# EAGLE schematic RubyWaves (EAGLE 9.6.2)
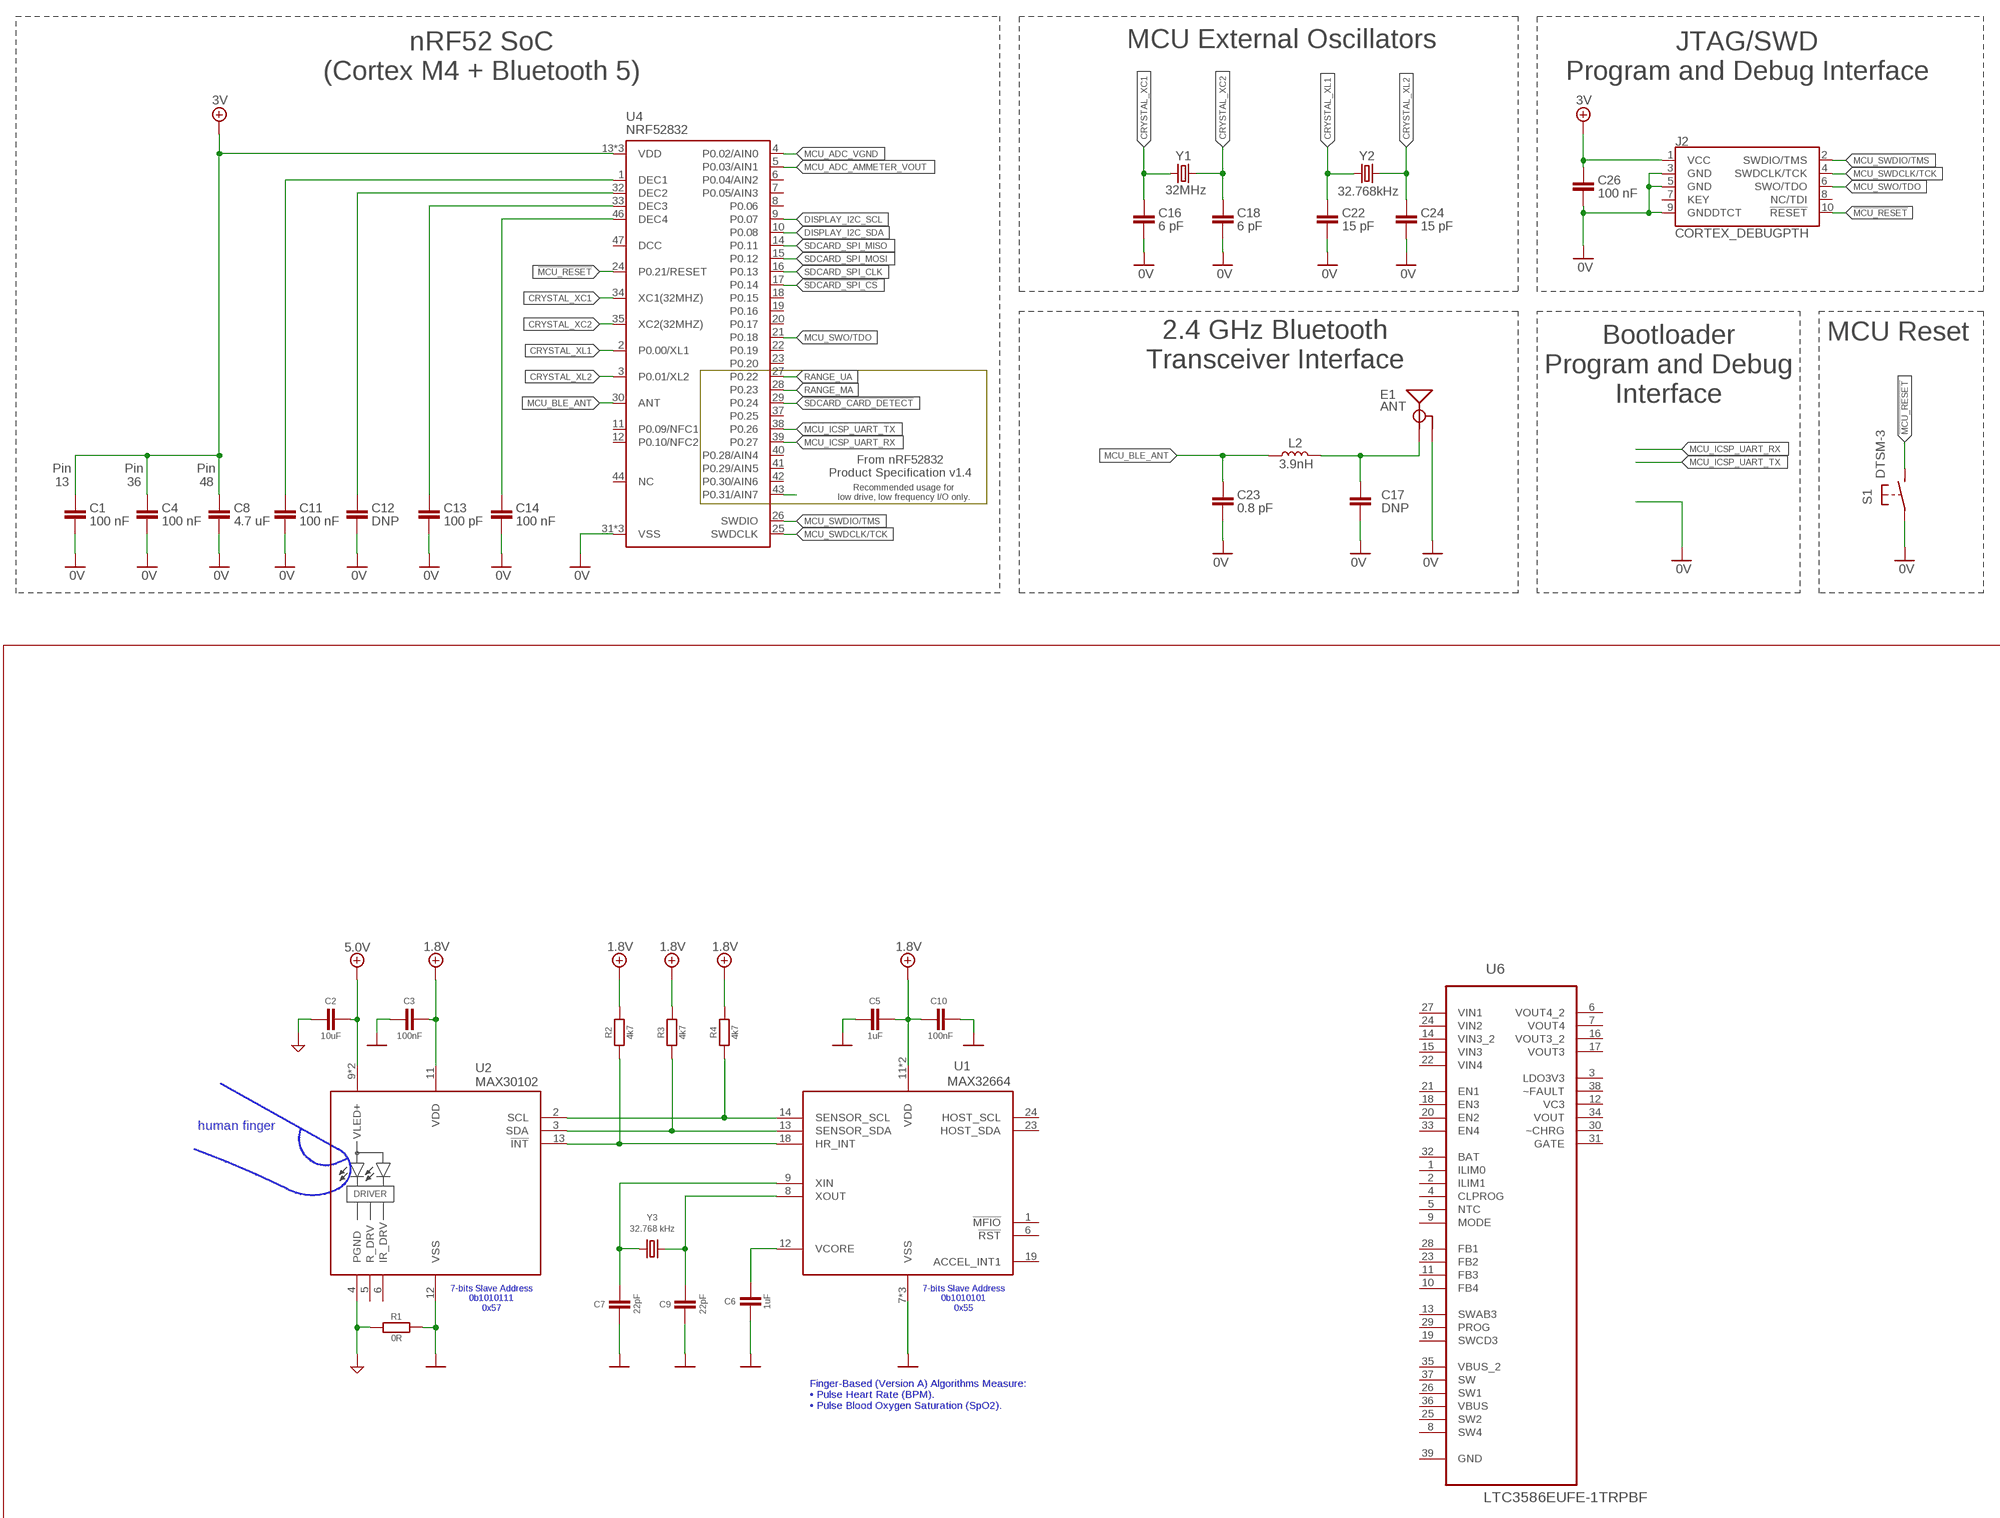
[diagram p0: schematic, sheet 1, part 1 of 2]
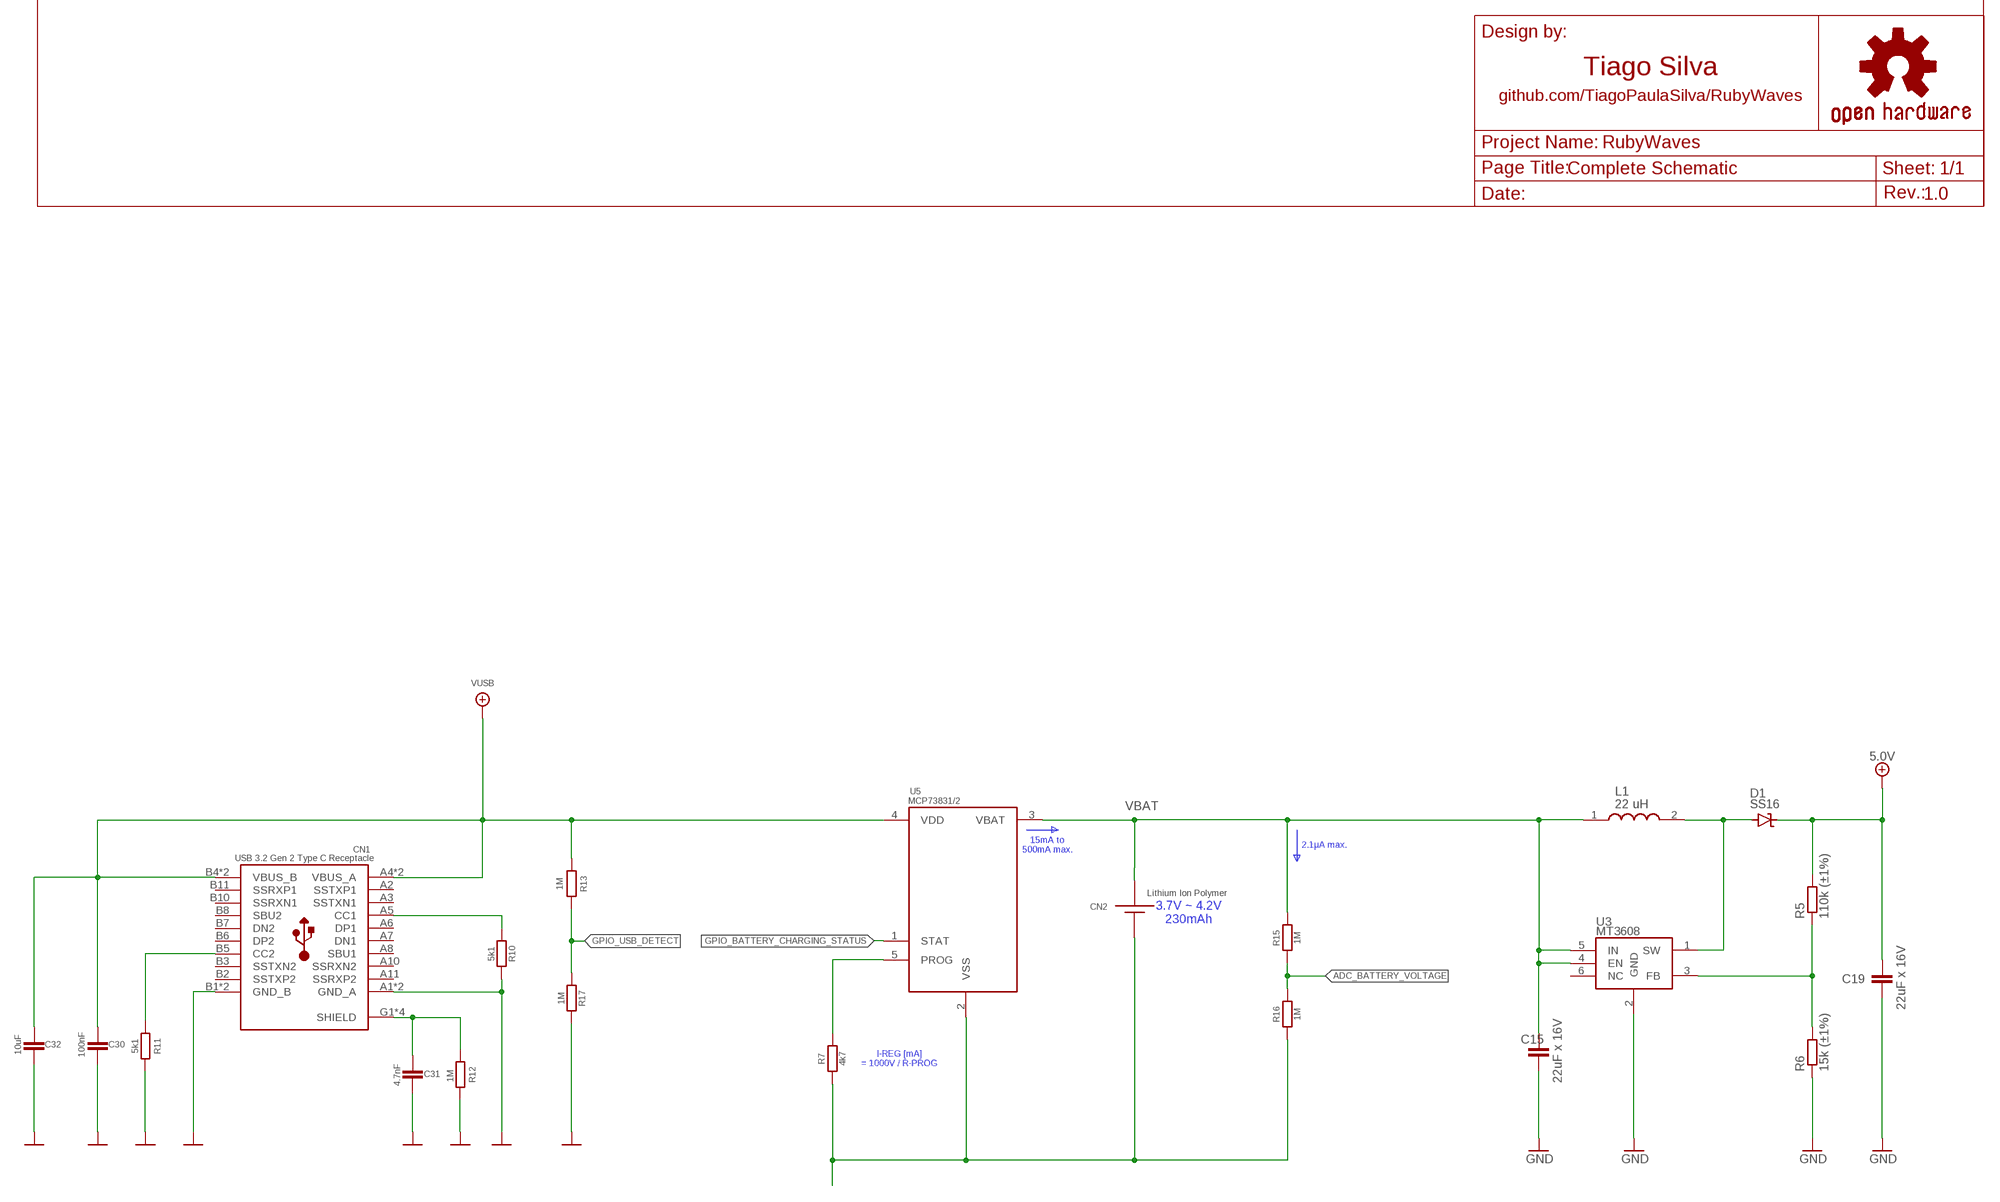
[diagram p1: schematic, sheet 1, part 2 of 2]

## Parts
C1  100 nF  C-EUC0603  [C0603]
C2  10uF  C_0603  [C0603]
C3  100nF  C_0603  [C0603]
C4  100 nF  C-EUC0603  [C0603]
C5  1uF  C_0603  [C0603]
C6  1uF  C_0603  [C0603]
C7  22pF  C_0603  [C0603]
C8  4.7 uF  C-EUC0603  [C0603]
C9  22pF  C_0603  [C0603]
C10  100nF  C_0603  [C0603]
C11  100 nF  C-EUC0603  [C0603]
C12  DNP  C-EUC0603  [C0603]
C13  100 pF  C-EUC0603  [C0603]
C14  100 nF  C-EUC0603  [C0603]
C15  22uF x 16V  C-EUC0805  [C0805]
C16  6 pF  C-EUC0603  [C0603]
C17  DNP  C-EUC0603  [C0603]
C18  6 pF  C-EUC0603  [C0603]
C19  22uF x 16V  C-EUC0805  [C0805]
C22  15 pF  C-EUC0603  [C0603]
C23  0.8 pF  C-EUC0603  [C0603]
C24  15 pF  C-EUC0603  [C0603]
C26  100 nF  C-EUC0603  [C0603]
C30  100nF  C_0603  [C0603]
C31  4.7nF  C_0603  [C0603]
C32  10uF  C_0603  [C0603]
CN1  USB 3.2 Gen 2 Type C Receptacle  USB4080-03-A  [GCT_USB4080-03-A_REVA]
CN2  Lithium Ion Polymer  BATTERYJST-2  [JST-PH-2-SMT-RA]
D1  SS16  SUPPRESSOR-SMBJ  [SMBJ]
E1  ANT  ANTENNA-GROUNDEDTRACE-15.2MM  [TRACE_ANTENNA_2.4GHZ_15.2MM]
J2  CORTEX_DEBUGPTH  [2X5-PTH-1.27MM]
L1  22 uH  INDUCTOR  [INDUCTOR]
L2  3.9nH  INDUCTOR-0402-3.9NH  [0402]
R1  0R  R_0603  [R0603]
R2  4k7  R_0603  [R0603]
R3  4k7  R_0603  [R0603]
R4  4k7  R_0603  [R0603]
R5  110k (±1%)  R-EU_R0603  [R0603]
R6  15k (±1%)  R-EU_R0603  [R0603]
R7  4k7  R_0603  [R0603]
R10  5k1  R_0603  [R0603]
R11  5k1  R_0603  [R0603]
R12  1M  R_0603  [R0603]
R13  1M  R_0603  [R0603]
R15  1M  R_0603  [R0603]
R16  1M  R_0603  [R0603]
R17  1M  R_0603  [R0603]
S1  DTSM-3  [SMD-2P]
U1  MAX32664  [TQFN-24]
U2  MAX30102  [OESIP-14]
U3  MT3608  [SOT95P280X145-6N]
U4  NRF52832  [QFN48-6X6MM]
U5  MCP73831/2  MCP73831/OT  [SOT23-5L]
U6  LTC3586EUFE-1TRPBF  [QFN40P400X600X80-39N]
Y1  32MHz  CRYSTAL-32MHZ-SMD-2.0X1.6MM  [CRYSTAL-SMD-2.0X1.6MM]
Y2  32.768kHz  CRYSTAL-32.768KHZSMD-3.2X1.5  [CRYSTAL-SMD-3.2X1.5MM]
Y3  32.768 kHz  CRYSTAL-MINI  [3.2X1.5]

## Nets
0V: C1.2 C4.2 C8.2 C11.2 C12.2 C13.2 C14.2 C16.2 C17.2 C18.2 C22.2 C23.2 C24.2 C26.2 C30.1 C31.1 C32.1 CN1.A1(GND_A) CN1.A12(GND_A) CN1.B1(GND_B) CN1.B12(GND_B) E1.GND J2.3(GND) J2.5(GND) J2.9(GNDDTCT) R10.2 R11.2 R12.2 R17.1 S1.1 U4.31(VSS) U4.45(VSS) U4.EP(VSS)
0V1: CN2.2(GND) R7.1 R16.1 U5.2(VSS)
1.8V: C3.1 C5.1 C10.1 R2.2 R3.2 R4.2 U1.11(VDD) U1.22(VDD) U2.11(VDD)
5.0V: C2.1 C19.1 D1.C R5.2 U2.9(VLED+) U2.10(VLED+)
!BIO_SENSOR_TRIGGER_INTERRUPT: R2.1 U1.18(HR_INT) U2.13(!INT)
!MCU_RESET!: J2.10(!RESET) S1.2 U4.24(P0.21/RESET)
!SDCARD_CARD_DETECT!: U4.29(P0.24)
!SDCARD_SPI_CS!: U4.17(P0.14)
+5V: C1.1 C4.1 C8.1 C26.1 J2.1(VCC) U4.13(VDD) U4.36(VDD) U4.48(VDD) ; supply symbol labelled 3V
ADC_BATTERY_VOLTAGE: R15.1 R16.2
CRYSTAL_XC1: C16.1 U4.34(XC1(32MHZ)) Y1.3
CRYSTAL_XC2: C18.1 U4.35(XC2(32MHZ)) Y1.1
CRYSTAL_XL1: C22.1 U4.2(P0.00/XL1) Y2.P$2
CRYSTAL_XL2: C24.1 U4.3(P0.01/XL2) Y2.P$1
DGND: C2.2 R1.1 U2.4(PGND)
DISPLAY_I2C_SCL: U4.9(P0.07)
DISPLAY_I2C_SDA: U4.10(P0.08)
GND [gnd]: C15.2 C19.2 R6.1 U3.2(GND)
GPIO_BATTERY_CHARGING_STATUS: U5.1(STAT)
GPIO_USB_DETECT: R13.1 R17.2
MCU_ADC_AMMETER_VOUT: U4.5(P0.03/AIN1)
MCU_ADC_VGND: U4.4(P0.02/AIN0)
MCU_BLE_ANT: C23.1 L2.2 U4.30(ANT)
MCU_ICSP_UART_RX: U4.39(P0.27)
MCU_ICSP_UART_TX: U4.38(P0.26)
MCU_SWDCLK/TCK: J2.4(SWDCLK/TCK) U4.25(SWDCLK)
MCU_SWDIO/TMS: J2.2(SWDIO/TMS) U4.26(SWDIO)
MCU_SWO/TDO: J2.6(SWO/TDO) U4.21(P0.18)
N$1: R4.1 U1.14(SENSOR_SCL) U2.2(SCL)
N$2: R3.1 U1.13(SENSOR_SDA) U2.3(SDA)
N$3: C6.1 U1.12(VCORE)
N$4: D1.A L1.2 U3.1(SW)
N$5: R5.1 R6.2 U3.3(FB)
N$8: C11.1 U4.1(DEC1)
N$10: CN1.A5(CC1) R10.1
N$11: C17.1 E1.ANT(SIGNAL) L2.1
N$12: C12.1 U4.32(DEC2)
N$13: C13.1 U4.33(DEC3)
N$14: C31.2 CN1.G1(SHIELD) CN1.G2(SHIELD) CN1.G3(SHIELD) CN1.G4(SHIELD) R12.1
N$15: C14.1 U4.46(DEC4)
N$21: CN1.B5(CC2) R11.1
N$26: R7.2 U5.5(PROG)
P31: U4.43(P0.31/AIN7)
RANGE_MA: U4.28(P0.23)
RANGE_UA: U4.27(P0.22)
SDCARD_SPI_CLK: U4.16(P0.13)
SDCARD_SPI_MISO: U4.14(P0.11)
SDCARD_SPI_MOSI: U4.15(P0.12)
VBAT: C15.1 CN2.1(VDD) L1.1 R15.2 U3.4(EN) U3.5(IN) U5.3(VBAT)
VSS: C3.2 C5.2 C6.2 C7.2 C9.2 C10.2 R1.2 U1.7(VSS) U1.10(VSS) U1.EP(VSS) U2.12(VSS)
VUSB: C30.2 C32.2 CN1.A4(VBUS_A) CN1.A9(VBUS_A) CN1.B4(VBUS_B) CN1.B9(VBUS_B) R13.2 U5.4(VDD)
XTAL_IN: C7.1 U1.9(XIN) Y3.1
XTAL_OUT: C9.1 U1.8(XOUT) Y3.2
Unconnected: CN1.A2(SSTXP1) CN1.A3(SSTXN1) CN1.A6(DP1) CN1.A7(DN1) CN1.A8(SBU1) CN1.A10(SSRXN2) CN1.A11(SSRXP2) CN1.B2(SSTXP2) CN1.B3(SSTXN2) CN1.B6(DP2) CN1.B7(DN2) CN1.B8(SBU2) CN1.B10(SSRXN1) CN1.B11(SSRXP1) J2.7(KEY) J2.8(NC/TDI) U1.1(!MFIO) U1.6(!RST) U1.19(ACCEL_INT1) U1.23(HOST_SDA) U1.24(HOST_SCL) U2.5(R_DRV) U2.6(IR_DRV) U3.6(NC) U4.6(P0.04/AIN2) U4.7(P0.05/AIN3) U4.8(P0.06) U4.11(P0.09/NFC1) U4.12(P0.10/NFC2) U4.18(P0.15) U4.19(P0.16) U4.20(P0.17) U4.22(P0.19) U4.23(P0.20) U4.37(P0.25) U4.40(P0.28/AIN4) U4.41(P0.29/AIN5) U4.42(P0.30/AIN6) U4.44(NC) U4.47(DCC) U6.1(ILIM0) U6.2(ILIM1) U6.3(LDO3V3) U6.4(CLPROG) U6.5(NTC) U6.6(VOUT4_2) U6.7(VOUT4) U6.8(SW4) U6.9(MODE) U6.10(FB4) U6.11(FB3) U6.12(VC3) U6.13(SWAB3) U6.16(VOUT3_2) U6.17(VOUT3) U6.18(EN3) U6.19(SWCD3) U6.20(EN2) U6.21(EN1) U6.23(FB2) U6.25(SW2) U6.26(SW1) U6.28(FB1) U6.29(PROG) U6.30(~CHRG) U6.31(GATE) U6.32(BAT) U6.33(EN4) U6.34(VOUT) U6.37(SW) U6.38(~FAULT) U6.39(GND)

## Notes on the sheet
- MCU External Oscillators
- nRF52 SoC
  (Cortex M4 + Bluetooth 5)
- JTAG/SWD
  Program and Debug Interface
- MCU Reset
- 2.4 GHz Bluetooth
  Transceiver Interface
- Bootloader
  Program and Debug
  Interface
- From nRF52832
  Product Specification v1.4
- Pin
  13
- Pin
  36
- Pin
  48
- Recommended usage for
  low drive, low frequency I/O only.
- human finger
- 7-bits Slave Address
  0b1010111
  0x57
- 7-bits Slave Address
  0b1010101
  0x55
- Finger-Based (Version A) Algorithms Measure:
  • Pulse Heart Rate (BPM).
  • Pulse Blood Oxygen Saturation (SpO2).
- Tiago Silva
- github.com/TiagoPaulaSilva/RubyWaves
- Complete Schematic
- 1.0
- 15mA to
  500mA max.
- 2.1μA max.
- 3.7V ~ 4.2V
  230mAh
- I-REG [mA]
  = 1000V / R-PROG

## Power pins joined to a net without a drawn wire
VBUS: U6.36(VBUS)
VBUS_2: U6.35(VBUS_2)
VIN1: U6.27(VIN1)
VIN2: U6.24(VIN2)
VIN3: U6.15(VIN3)
VIN3_2: U6.14(VIN3_2)
VIN4: U6.22(VIN4)

## Library data of the parts
C1 C4 C8 C11-C19 C22-C24 C26 = rcl:C-EU: CAPACITOR, European symbol; SPICEPREFIX: C
C2 C3 C5 C6 C10 = My-RLC:C_: NON-POLARIZED CAP
C7 C9 = My-RLC:C_: NON-POLARIZED CAP; PARTNO: *; PN: C0603C220J1GACTU
C30-C32 = My-RLC:C_: NON-POLARIZED CAP; PARTNO: *
CN1 = USB C CONNECOTR:USB4080-03-A: USB-C (USB TYPE-C) USB 3.2 Gen 2 (USB 3.1 Gen 2, Superspeed + (USB 3.1)) Receptacle Connector 24 Position Surface Mount, Right Angle; Through Hole Check prices <https://pricing.snapeda.com/parts/USB4080-03-A/Global%20Connector%20Technology/view-part?ref=eda>; AVAILABILITY: In Stock; DESCRIPTION: USB-C (USB TYPE-C) USB 3.2 Gen 2 (USB 3.1 Gen 2, Superspeed + (USB 3.1)) Receptacle Connector 24 Position Surface Mount, Right Angle; Through Hole; MF: Global Connector Technology; MP: USB4080-03-A; PACKAGE: None; PARTNO: *; PRICE: None; PURCHASE-URL: https://pricing.snapeda.com/search/part/USB4080-03-A/?ref=eda
CN2 = Battery:BATTERY; PARTNO: *
D1 = diode:SUPPRESSOR-: Suppressor diode
E1 = SparkFun-RF:ANTENNA-GROUNDED: Antenna w/ Ground Connection 2.4GHz antennae with signal and ground terminals. TRACE_ANTENNA_2.4GHZ_15.2MM - Meander Trace antenna 15.2 x 5.7mm footprint Based on layout from TI app note AN043 <http://www.ti.com/lit/an/swra117d/swra117d.pdf>. TRACE_ANTENNA_2.4GHZ_25.7MM - Inverted F trace antenna 25.7 x 7.5 mm footprint. Based on layout from TI design note DN0007 <http://www.ti.com/lit/an/swru120b/swru120b.pdf>.
J2 = SparkFun-Connectors:CORTEX_DEBUG: Cortex Debug Connector Datasheet <http://infocenter.arm.com/help/topic/com.arm.doc.faqs/attached/13634/cortex_debug_connectors.pdf>
L1 = Inductor:INDUCTOR
L2 = nrf52832-breakout-temp:INDUCTOR: Inductors Resist changes in electrical current. Basically a coil of wire. SparkFun Products: SparkFun Load Cell Amplifier - HX711 <https://www.sparkfun.com/products/13879> IOIO-OTG - V2.2 <https://www.sparkfun.com/products/13613>; PROD_ID: NDUC-13457
R1-R4 = My-RLC:R_: RESISTOR
R5 R6 = rcl:R-EU_: RESISTOR, European symbol; SPICEPREFIX: R
R7 R10-R13 R15-R17 = My-RLC:R_: RESISTOR; PARTNO: *
S1 = switch-tact:DTSM-3
U1 = MAX32664:MAX32664: None Check availability <https://pricing.snapeda.com/parts/MAX3740AETG%2BT/Maxim%20Integrated/view-part?ref=eda>; PN: MAX32664GTGA+
U2 = MAX30102:MAX30102: Biomedical Sensors Integrated Optical Sensor Check availability <https://pricing.snapeda.com/parts/MAX30102EFD%2B/Maxim%20Integrated/view-part?ref=eda>; PN: MAX30102EFD+
U3 = MT3608:MT3608: High Efficiency 1.2MHz 2A Step Up Converter Source: Datasheet <https://www.olimex.com/Products/Breadboarding/BB-PWR-3608/resources/MT3608.pdf>; DESCRIPTION: High Efficiency 1.2MHz 2A Step Up Converter; HEIGHT: 1.45mm; MANUFACTURER_NAME: Aerosemi; MANUFACTURER_PART_NUMBER: MT3608
U4 = nrf52832-breakout-temp:NRF52832: Nordic nRF52832 Bluetooth Smart/ANT/2.4GHz RF SoC The nRF52832 SoC is a powerful, highly flexible ultra-low power multiprotocol SoC ideally suited for Bluetooth® Smart ANT and 2.4GHz ultra low-power wireless applications. The nRF52832 SoC is built around a 32-bit ARM® Cortex™-M4F CPU with 512kB + 64kB RAM. The embedded 2.4GHz transceiver supports Bluetooth Smart, ANT and proprietary 2.4 GHz protocol stack. It is on air compatible with the nRF51 Series, nRF24L and nRF24AP Series products from Nordic Semiconductor. Product Page <https://www.nordicsemi.com/eng/Products/Bluetooth-low-energy2/nRF52832>; PROD_ID: IC-13460
U5 = adafruit:MCP73831: MCP73831/2 Miniature Single-Cell, Fully Integrated Li-Ion, Li-Polymer Charge Management Controllers. Nice and small simple lipoly charge controller, with adjustable current and status output (LED) http://www.ladyada.net/library/pcb/eaglelibrary.html; PARTNO: *
U6 = LTC3586:LTC3586EUFE-1TRPBF: High Efficiency USB Power Manager with Boost, Buck-Boost and Dual Bucks Check availability <https://pricing.snapeda.com/parts/LTC3586EUFE-1%23TRPBF/Analog%20Devices/view-part?ref=eda>; AVAILABILITY: In Stock; DESCRIPTION: USB Power Manager 4.35V to 5.5V 38-Pin QFN EP T/R; MF: Analog Devices; MP: LTC3586EUFE-1#TRPBF; PACKAGE: QFN -38 Analog Devices; PRICE: None
Y1 = nrf52832-breakout-temp:CRYSTAL-32MHZ: 32MHz Crystal Digikey Example <http://www.digikey.com/product-detail/en/murata-electronics-north-america/XRCGB32M000F2P00R0/490-9769-1-ND/4952013> Frequency: 32MHz Frequency Stability: ±20ppm Frequency Tolerance: ±20ppm Load Capacitance: 6pF; PROD_ID: XTAL-13459
Y2 = SparkFun-Clocks:CRYSTAL-32.768KHZ: 32.768kHz Crystal Frequency: 32.768kHz Frequency Stability: ±20ppm Load Capacitance: 12.5pF (PTH-2X6 & SMD-3.2X1.5), 6pF (SMD-2X6) SparkFun Products: SparkFun BigTime Watch Kit <https://www.sparkfun.com/products/11734> SparkFun nRF52832 Breakout <https://www.sparkfun.com/products/13990> SparkFun Real Time Clock Module <https://www.sparkfun.com/products/12708>; PROD_ID: XTAL-13062
Y3 = crystal-geyer_V1_0:CRYSTAL-MINI; PARTNO: *; PN: CM7V-T1A-32.768k-9pF-20PPM-TA-QA T3

## Net classes
1 power: width 0.203 mm
2 gnd: width 0.305 mm, drill 0.559 mm, clearance 0.254 mm